# EasyEDA Pro project MicroPhone.eprj

# Schematic 麦克风
Board Name: 麦克风; Create Date: 2024-11-27
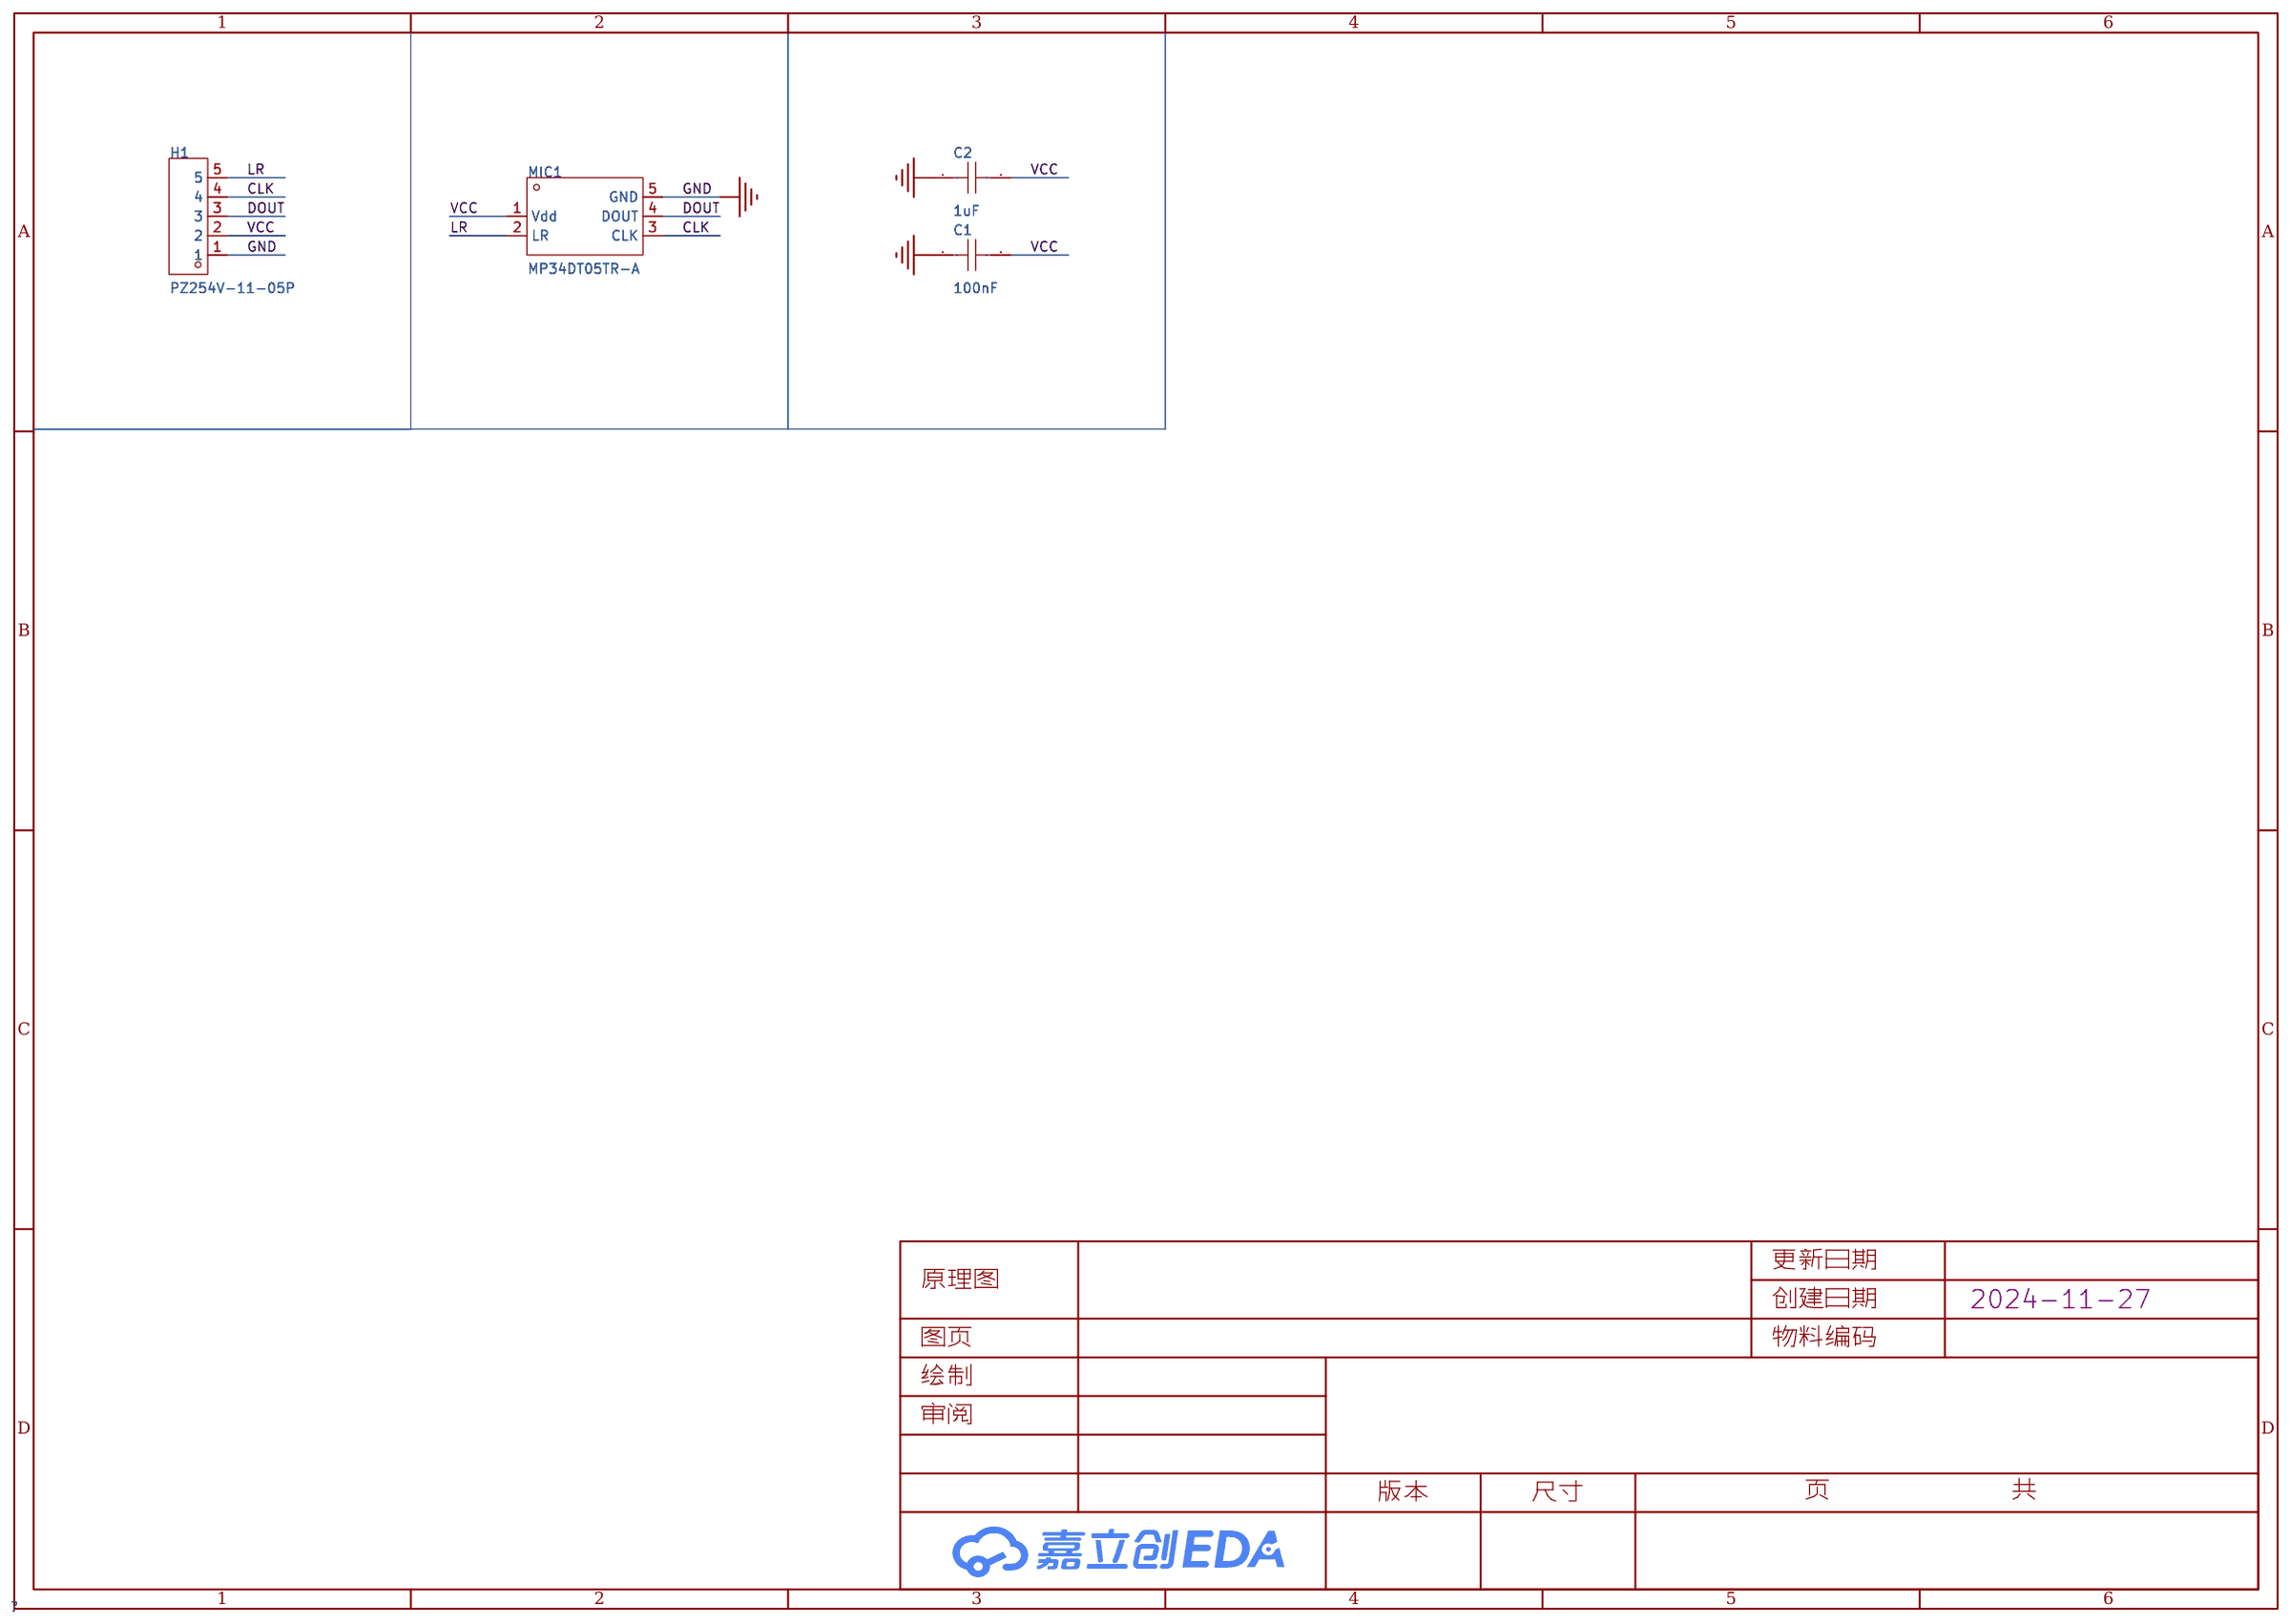
[diagram p0: schematic sheet]

## Parts
C1  100nF  [C0603]
C2  1uF  [C0603]
H1  PZ254V-11-05P  [HDR-TH_5P-P2.54-V-M]
MIC1  MP34DT05TR-A  [MIC-SMD_5P-L3.0-W4.0-P0.85-BL]

## Library data of the parts
C1 = CGA0603X7R104K500JT: LCSC Part Name: 100nF ±10% 50V; Supplier Part: C6119867; Manufacturer: HRE(芯声); Supplier Footprint: 0603; JLCPCB Part Class: 扩展库; Supplier: LCSC; Tolerance: ±10%; Voltage Rated: 50V; Temperature Coefficient: X7R
C2 = CGA0603X5R105K160JT: LCSC Part Name: 1uF ±10% 16V; Supplier Part: C6119849; Manufacturer: HRE(芯声); Supplier Footprint: 0603; JLCPCB Part Class: 扩展库; Supplier: LCSC; Tolerance: ±10%; Voltage Rated: 16V; Temperature Coefficient: X5R
H1 = PZ254V-11-05P: LCSC Part Name: 间距:2.54mm 1x5P 直插 方针; Supplier Part: C492404; Manufacturer: XFCN(兴飞); Supplier Footprint: 插件,P=2.54mm; JLCPCB Part Class: 扩展库; Datasheet: https://atta.szlcsc.com/upload/public/pdf/source/20200309/C492404_E51533260F8710EFF5D4617281164C1D.pdf; Supplier: LCSC; Pin Structure: 1x5P; Pitch: 2.54mm; Circluar Pins/Square Pins: 方针; Mounting Type: 直插; Number of Rows: 单排; Number of Pins: 5P; Length of Mating Pin: 6mm; Insulation Height: 2.5mm; Length of End Connection Pin: 3mm; Contact Material: 黄铜; Operating Temperature Range: -40℃~+105℃; Color: 黑色
MIC1 = MP34DT05TR-A: Supplier Part: C2688664; Manufacturer: ST(意法半导体); Supplier Footprint: HCLGA-4LD(3x4); JLCPCB Part Class: 扩展库; Datasheet: https://atta.szlcsc.com/upload/public/pdf/source/20210205/C2688664_535B04288C825B3B153C08EB8B884814.pdf; Supplier: LCSC; Direction: 全指向; Supply Voltage: 1.8V; Current Consumption: 650uA; SNR(Signal to Noise Ratio): 64dB; Sensitivity: -26dB

## Nets
GND: C1.1 C2.1 H1.1 MIC1.5(GND)
VCC: C1.2 C2.2 H1.2 MIC1.1(Vdd)
CLK: H1.4 MIC1.3(CLK)
DOUT: H1.3 MIC1.4(DOUT)
LR: H1.5 MIC1.2(LR)

# Board 麦克风
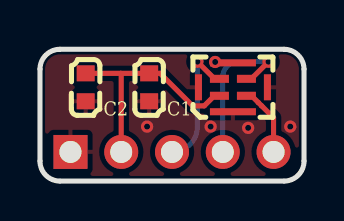
[diagram p1: board, top side]
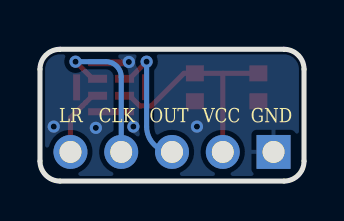
[diagram p2: board, bottom side, seen from below]

Outline 13.21 x 6.6 mm; copper layers: Top Layer, Bottom Layer. Coordinates in mm from the lower left corner of the outline.
Outline path: 0,5.6 0,1 arc(0.29,0.29) 1,0 12.21,0 arc(12.92,0.29) 13.21,1 13.21,5.6 arc(12.92,6.31) 12.21,6.6 1,6.6 arc(0.29,6.31) 0,5.6
Stack: Top Layer 0.035mm / Dielectric1 1.51mm FR4 er 4.5 / Bottom Layer 0.035mm

## Design rules (mm)
template: JLCPCB Capability(Two Layers Board)
spacing copperThickness1oz (default): track to track 0.102, other pairs 0.152 to 0.3
spacing copperThickness2oz: track to track 0.203, other pairs 0.152 to 0.3
track width copperThickness1oz (default): min 0.127, default 0.254, max 2.54
track width copperThickness2oz: min 0.203, default 0.254, max 2.54
differential pair differentialPair (default): width min 0.127, default 0.254, max 2.54; gap min 0.152, default 0.152
via viaSize (default): diameter min 0.5, default 0.61, max 10; hole min 0.3, default 0.305, max 6.3

## Placement (name value [footprint] x y rotation side)
C1  100nF  [C0603]  5.46 4.7 90 top
C2  1uF  [C0603]  2.29 4.7 90 top
H1  PZ254V-11-05P  [HDR-TH_5P-P2.54-V-M]  6.6 1.46 0 top
MIC1  MP34DT05TR-A  [MIC-SMD_5P-L3.0-W4.0-P0.85-BL]  9.65 4.7 0 top

## Footprints (pads in the part's own frame, mm; a bottom-side part is the same pattern mirrored in y, then rotated)
C0603
  rect 0.8x0.9 smd: 1(-0.7,0) 2(0.7,0)
HDR-TH_5P-P2.54-V-M
  rect 1.7x1.7 hole 1.1: 1(-5.08,0)
  round 1.7 hole 1.1: 2(-2.54,0) 3(0,0) 4(2.54,0) 5(5.08,0)
MIC-SMD_5P-L3.0-W4.0-P0.85-BL
  rect 0.95x0.4 smd: 1(-0.675,-0.425) 2(0.675,-0.425) 3(0.675,0.425) 4(-0.675,0.425)
  rect 0.35x1.3 smd: 5(-1.725,0) 5(1.725,0)
  rect 2.3x0.35 smd: 5(0,1.225) 5(0,-1.225)

## Nets
As in the schematic.

## Via types
v1: diameter 0.61, hole 0.305, Top Layer to Bottom Layer, 7 vias

## Routing (per net, layer and track width the routed paths; a pad name or vN(x,y) marks a point on that pad's centre or on a via; arc(x,y) is an arc through that point)
GND:
  vias: v1(5.36,2.73) v1(8.54,2.73) v1(8.76,5.97) v1(10.41,2.67) v1(12.52,2.73)
VCC: length 11.5
  Top Layer w0.254: C2.2 4.05,5.4 ; 4.05,5.4 C1.2 6.01,5.4 7.64,3.77 8.22,3.77 8.72,4.27 MIC1.1 ; 4.05,5.4 arc(4.06,5.39) 4.06,5.38 H1.2
CLK: length 7.9
  Top Layer w0.254: MIC1.3 10.57,5.12 v1(11.43,5.98)
  Bottom Layer w0.254: 9.14,1.46 9.14,5.22 arc(9.37,5.76) 9.91,5.98 v1(11.43,5.98)
DOUT: length 6.7
  Top Layer w0.254: MIC1.4 8.73,5.12 v1(7.87,5.98)
  Bottom Layer w0.254: v1(7.87,5.98) 7.87,2.73 arc(7.5,1.83) H1.3
LR: length 3.5
  Top Layer w0.254: H1.5 11.68,3.17 11.09,3.77 11.09,3.77 10.92,3.93 10.92,3.94 10.59,4.27 MIC1.2

## Copper pours and planes (outline as drawn; the poured copper is in the pictures)
GND on Top Layer: -0.25,6.86 13.46,6.86 13.46,-0.25 -0.25,-0.25
GND on Bottom Layer: -0.25,6.86 13.46,6.86 13.46,-0.25 -0.25,-0.25

## Text on the board
Bottom Solder Mask Layer: Microod
Bottom Silkscreen Layer: GND | VCC | OUT | CLK | LR
Document Layer: Microod
